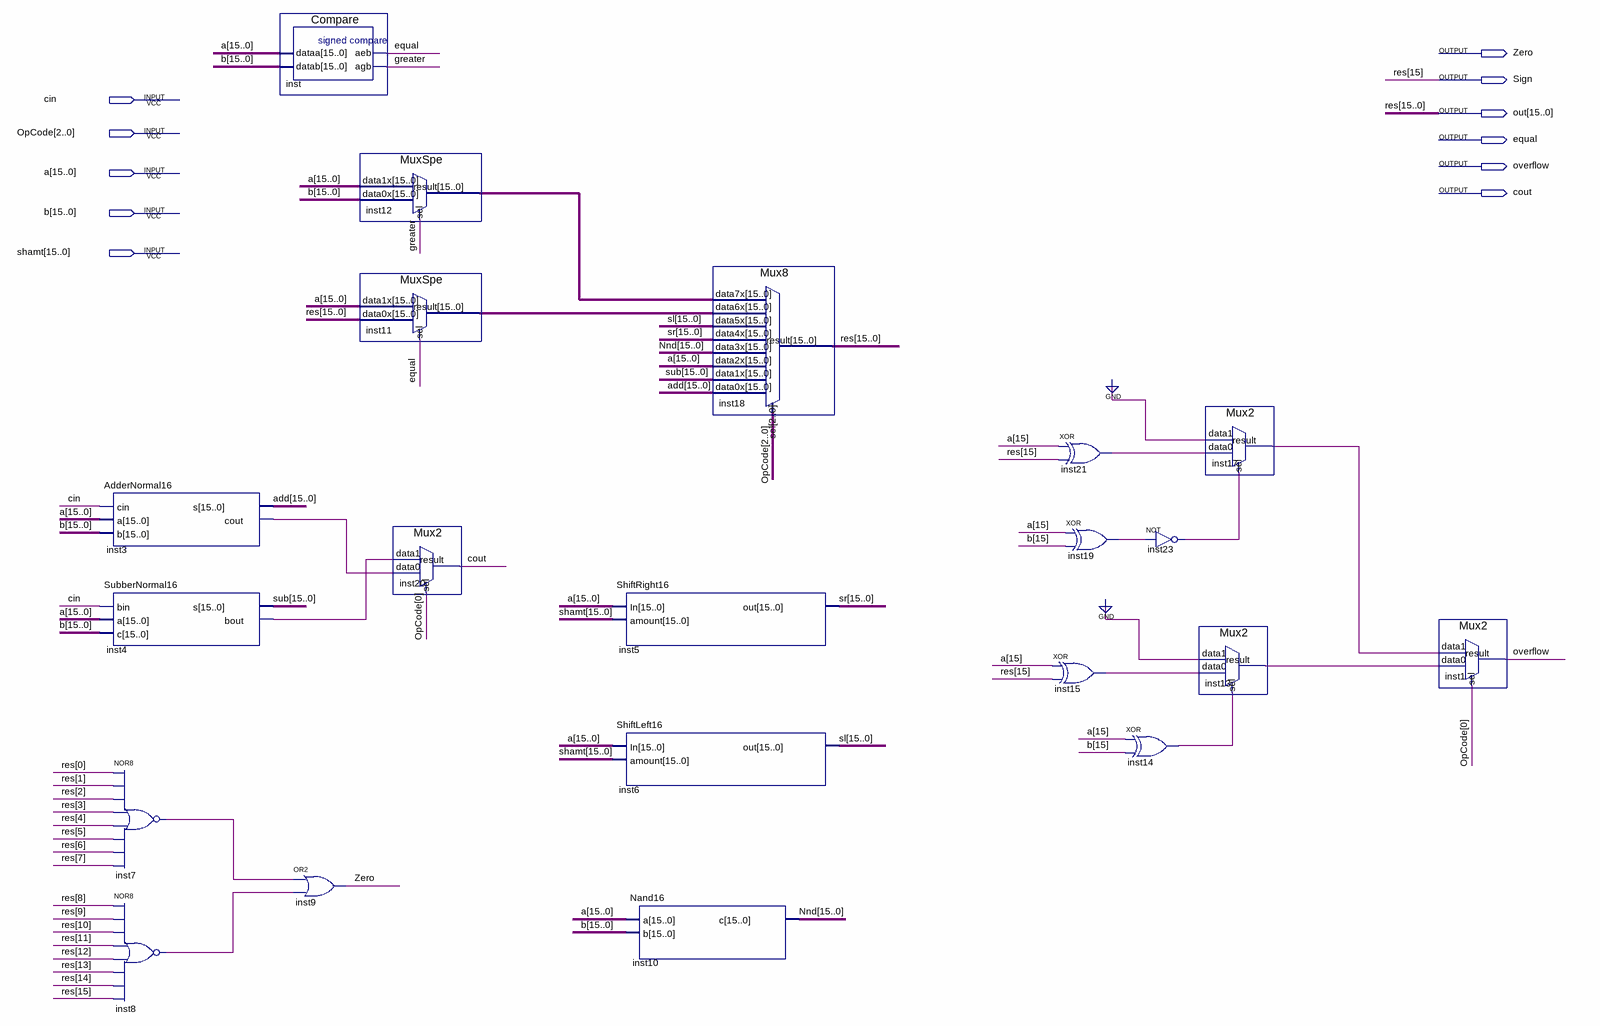
[diagram p0: schematic sheet]
// Quartus schematic ALU.bdf as structural Verilog: 21 symbols, 11 pins
module ALU (
  input  cin,
  input  [2:0] OpCode,
  input  [15:0] a,
  input  [15:0] b,
  input  [15:0] shamt,
  output Zero,
  output Sign,
  output [15:0] out,
  output equal,
  output overflow,
  output cout
);

  wire greater, inst3_cout, inst4_bout, inst7_out, inst8_out, inst13_result, inst14_out, inst15_out,
       inst17_result, inst19_out, inst21_out, inst23_out;
  wire [15:0] add, inst11_result, inst12_result, Nnd, sl, sr, sub;

  AdderNormal16 inst3 (.cin(cin), .a(a), .b(b), .s(add), .cout(inst3_cout));
  SubberNormal16 inst4 (.bin(cin), .a(a), .c(b), .s(sub), .bout(inst4_bout));
  nor inst7 (inst7_out, out[0], out[1], out[2], out[3], out[4], out[5], out[6], out[7]);
  nor inst8 (inst8_out, out[8], out[9], out[10], out[11], out[12], out[13], out[14], out[15]);
  Compare inst (.dataa(a), .datab(b), .aeb(equal), .agb(greater));
  or inst9 (Zero, inst7_out, inst8_out);
  MuxSpe inst12 (.data1x(a), .data0x(b), .sel(greater), .result(inst12_result));
  MuxSpe inst11 (.data1x(a), .data0x(out), .sel(equal), .result(inst11_result));
  Mux2 inst20 (.data1(inst4_bout), .data0(inst3_cout), .sel(OpCode[0]), .result(cout));
  ShiftRight16 inst5 (.In(a), .amount(shamt), .out(sr));
  ShiftLeft16 inst6 (.In(a), .amount(shamt), .out(sl));
  Nand16 inst10 (.a(a), .b(b), .c(Nnd));
  Mux8 inst18 (
    .data7x(inst12_result), .data6x(inst11_result), .data5x(sl), .data4x(sr), .data3x(Nnd), .data2x(a),
    .data1x(sub), .data0x(add), .sel(OpCode), .result(out));
  xor inst21 (inst21_out, a[15], out[15]);
  xor inst19 (inst19_out, a[15], b[15]);
  xor inst15 (inst15_out, a[15], out[15]);
  xor inst14 (inst14_out, a[15], b[15]);
  not inst23 (inst23_out, inst19_out);
  Mux2 inst17 (.data1(1'b0), .data0(inst21_out), .sel(inst23_out), .result(inst17_result));
  Mux2 inst13 (.data1(1'b0), .data0(inst15_out), .sel(inst14_out), .result(inst13_result));
  Mux2 inst1 (.data1(inst17_result), .data0(inst13_result), .sel(OpCode[0]), .result(overflow));

  assign Sign = out[15];

  // Other names for the same wires on the sheet: res[15:0] = out
endmodule
